# Altium schematic sheet Page06 CPU IO.SchDoc
size 513 x 386 mm
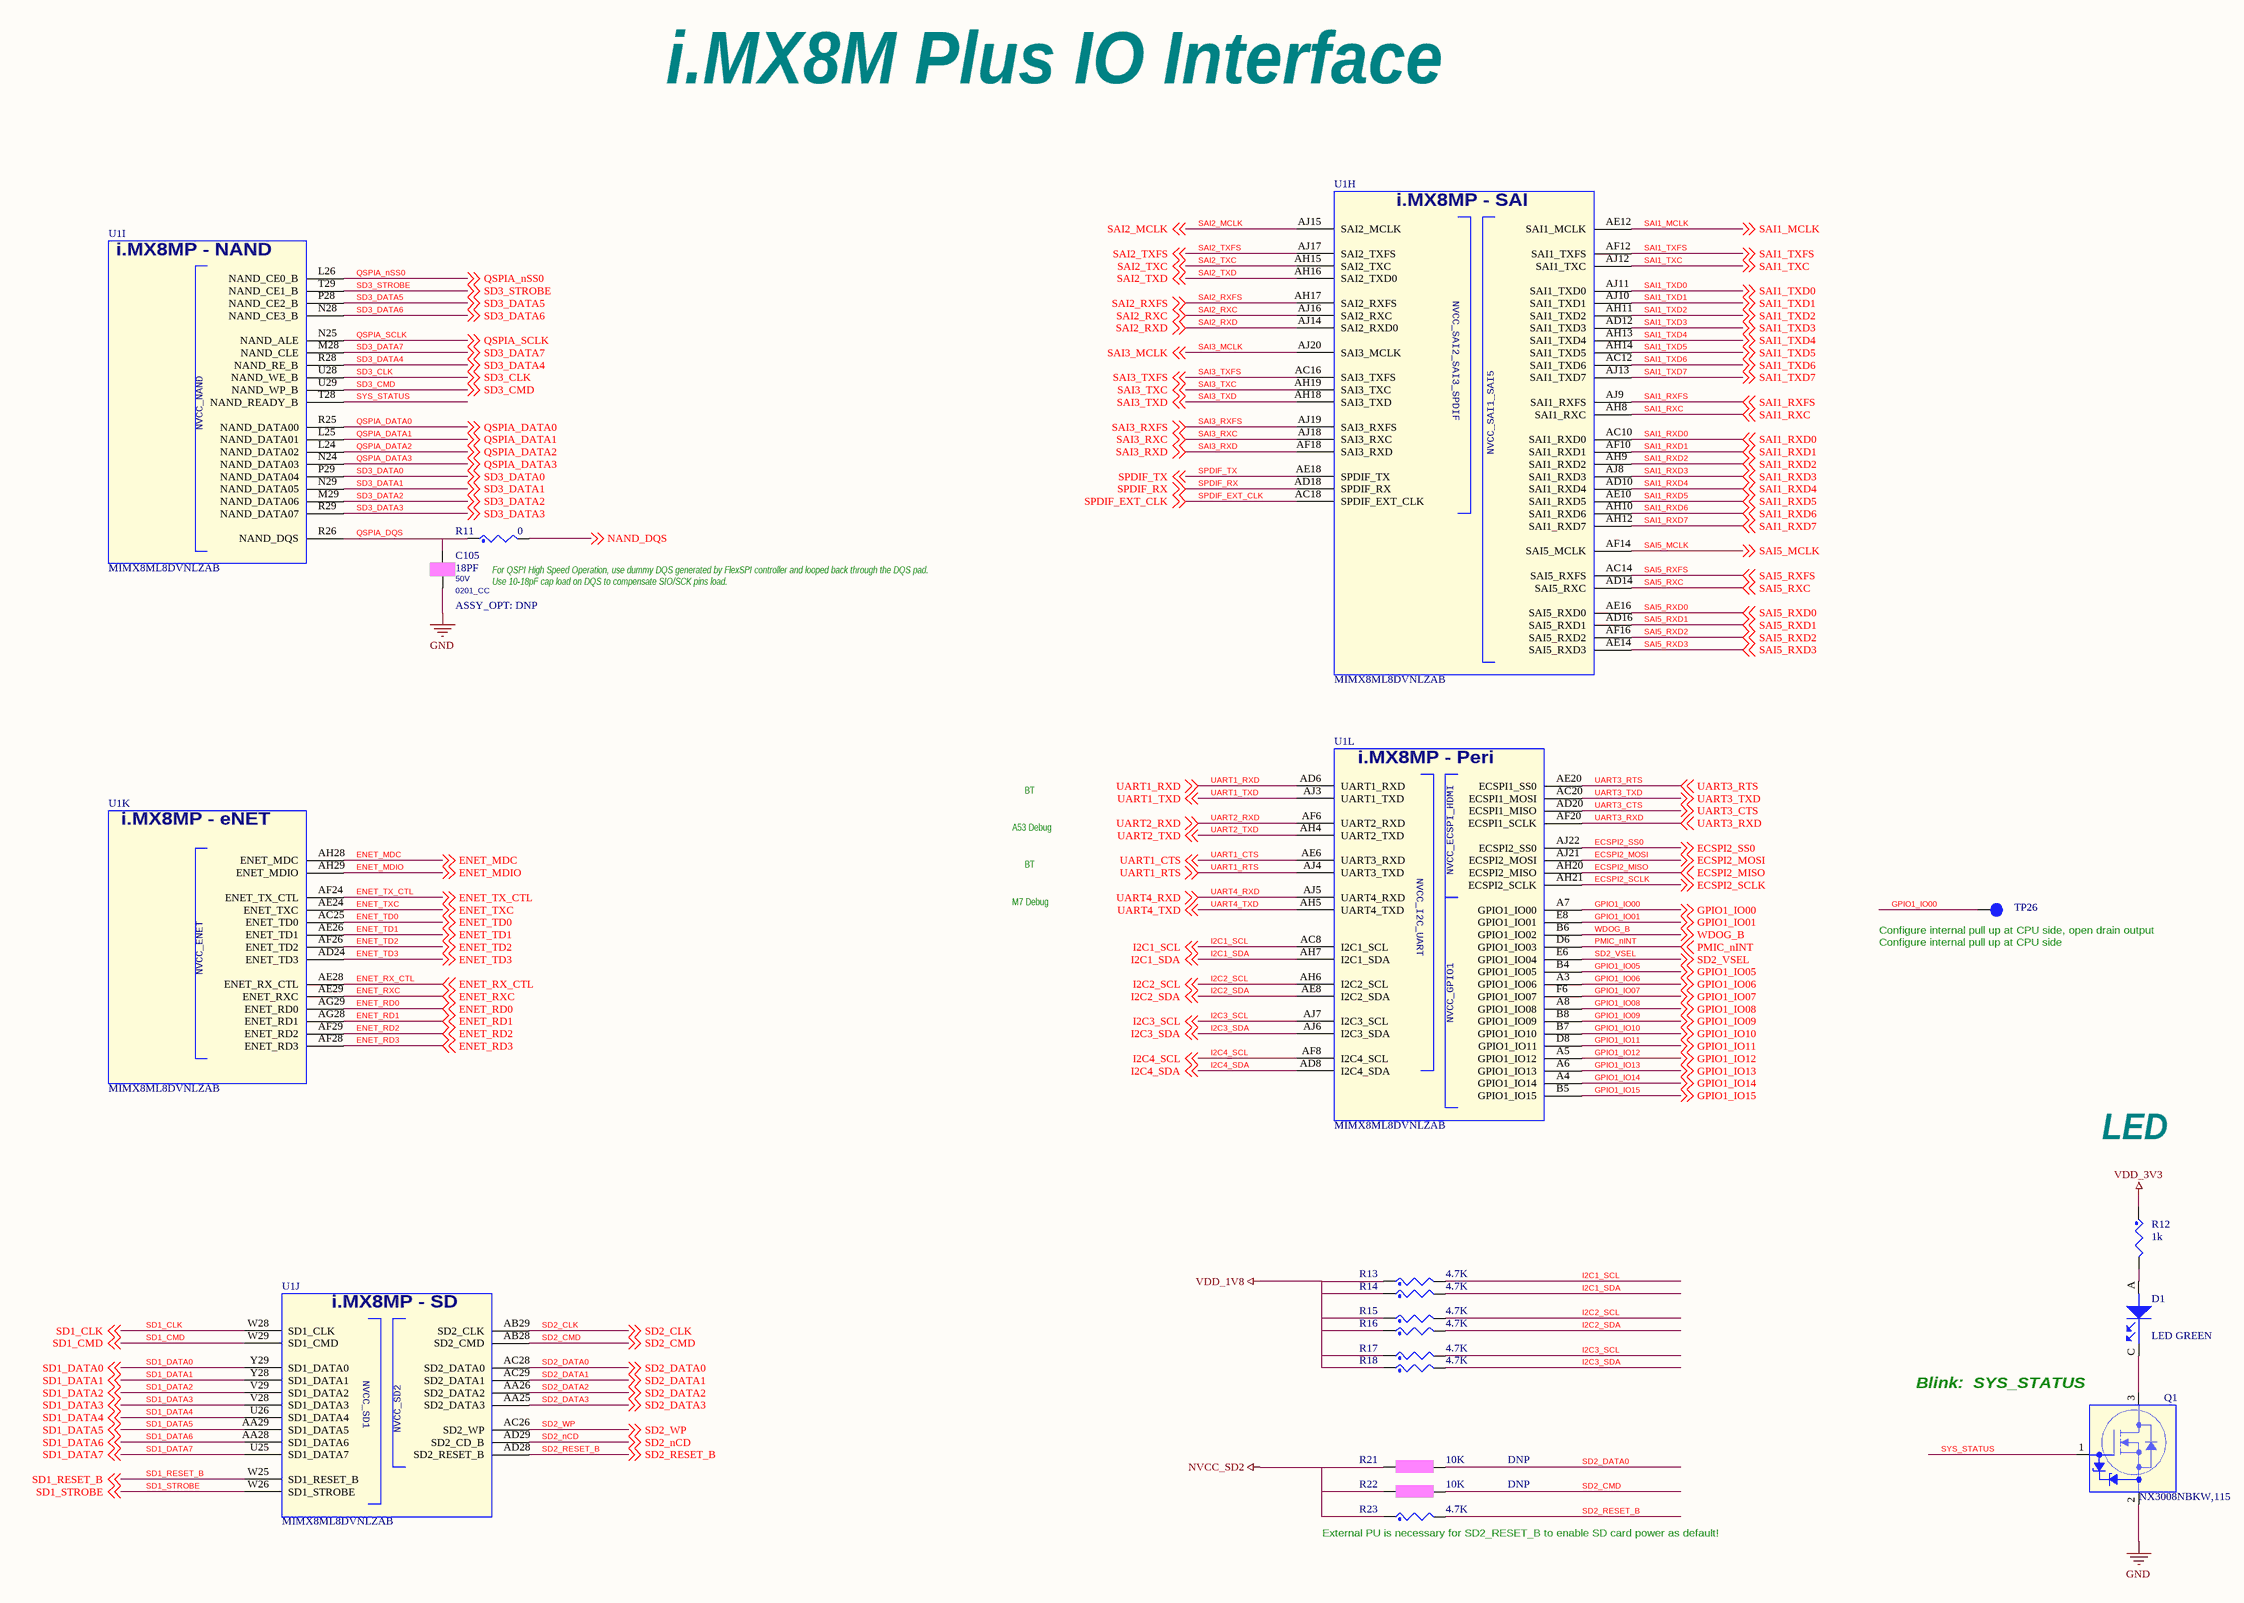
[diagram p0: Page06 CPU IO.SchDoc]

## Parts
C105  18PF  ASSY_OPT: DNP  VOLTAGE: 50V  [0201_CC]
D1  LED GREEN  [LED_0603]
Q1  NX3008NBKW,115  [sc70_3]
R11  0  [RC0402_25]
R12  1k  [0402_CC]
R13  4.7K  [0201_CC]
R14  4.7K  [0201_CC]
R15  4.7K  [0201_CC]
R16  4.7K  [0201_CC]
R17  4.7K  [0201_CC]
R18  4.7K  [0201_CC]
R21  10K  ASSY_OPT: DNP  [0201_CC]
R22  10K  ASSY_OPT: DNP  [0201_CC]
R23  4.7K  [0201_CC]
TP26  tpad_020  [tpad_020]  (value not drawn)
U1  MIMX8ML8DVNLZAB  [BGA_M865S_0P5_15X15-BMS]  (parts H,I,J,K,L of 15)

## Nets
GND: C105.2 Q1.2(SOURCE)
NVCC_SD2: R21.1 R22.1 R23.1
VDD_1V8: R13.1 R14.1 R15.1 R16.1 R17.1 R18.1
VDD_3V3: R12.1
ECSPI2_MISO: U1.AH20(ECSPI2_MISO) ; off-sheet ECSPI2_MISO
ECSPI2_MOSI: U1.AJ21(ECSPI2_MOSI) ; off-sheet ECSPI2_MOSI
ECSPI2_SCLK: U1.AH21(ECSPI2_SCLK) ; off-sheet ECSPI2_SCLK
ECSPI2_SS0: U1.AJ22(ECSPI2_SS0) ; off-sheet ECSPI2_SS0
ENET_MDC: U1.AH28(ENET_MDC) ; off-sheet ENET_MDC
ENET_MDIO: U1.AH29(ENET_MDIO) ; off-sheet ENET_MDIO
ENET_RD0: U1.AG29(ENET_RD0) ; off-sheet ENET_RD0
ENET_RD1: U1.AG28(ENET_RD1) ; off-sheet ENET_RD1
ENET_RD2: U1.AF29(ENET_RD2) ; off-sheet ENET_RD2
ENET_RD3: U1.AF28(ENET_RD3) ; off-sheet ENET_RD3
ENET_RX_CTL: U1.AE28(ENET_RX_CTL) ; off-sheet ENET_RX_CTL
ENET_RXC: U1.AE29(ENET_RXC) ; off-sheet ENET_RXC
ENET_TD0: U1.AC25(ENET_TD0) ; off-sheet ENET_TD0
ENET_TD1: U1.AE26(ENET_TD1) ; off-sheet ENET_TD1
ENET_TD2: U1.AF26(ENET_TD2) ; off-sheet ENET_TD2
ENET_TD3: U1.AD24(ENET_TD3) ; off-sheet ENET_TD3
ENET_TX_CTL: U1.AF24(ENET_TX_CTL) ; off-sheet ENET_TX_CTL
ENET_TXC: U1.AE24(ENET_TXC) ; off-sheet ENET_TXC
GPIO1_IO00: TP26.1(Pin1) U1.A7(GPIO1_IO00) ; off-sheet GPIO1_IO00
GPIO1_IO01: U1.E8(GPIO1_IO01) ; off-sheet GPIO1_IO01
GPIO1_IO05: U1.B4(GPIO1_IO05) ; off-sheet GPIO1_IO05
GPIO1_IO06: U1.A3(GPIO1_IO06) ; off-sheet GPIO1_IO06
GPIO1_IO07: U1.F6(GPIO1_IO07) ; off-sheet GPIO1_IO07
GPIO1_IO08: U1.A8(GPIO1_IO08) ; off-sheet GPIO1_IO08
GPIO1_IO09: U1.B8(GPIO1_IO09) ; off-sheet GPIO1_IO09
GPIO1_IO10: U1.B7(GPIO1_IO10) ; off-sheet GPIO1_IO10
GPIO1_IO11: U1.D8(GPIO1_IO11) ; off-sheet GPIO1_IO11
GPIO1_IO12: U1.A5(GPIO1_IO12) ; off-sheet GPIO1_IO12
GPIO1_IO13: U1.A6(GPIO1_IO13) ; off-sheet GPIO1_IO13
GPIO1_IO14: U1.A4(GPIO1_IO14) ; off-sheet GPIO1_IO14
GPIO1_IO15: U1.B5(GPIO1_IO15) ; off-sheet GPIO1_IO15
I2C1_SCL: R13.2 U1.AC8(I2C1_SCL) ; off-sheet I2C1_SCL
I2C1_SDA: R14.2 U1.AH7(I2C1_SDA) ; off-sheet I2C1_SDA
I2C2_SCL: R15.2 U1.AH6(I2C2_SCL) ; off-sheet I2C2_SCL
I2C2_SDA: R16.2 U1.AE8(I2C2_SDA) ; off-sheet I2C2_SDA
I2C3_SCL: R17.2 U1.AJ7(I2C3_SCL) ; off-sheet I2C3_SCL
I2C3_SDA: R18.2 U1.AJ6(I2C3_SDA) ; off-sheet I2C3_SDA
I2C4_SCL: U1.AF8(I2C4_SCL) ; off-sheet I2C4_SCL
I2C4_SDA: U1.AD8(I2C4_SDA) ; off-sheet I2C4_SDA
NAND_DQS: R11.2 ; off-sheet NAND_DQS
PMIC_nINT: U1.D6(GPIO1_IO03) ; off-sheet PMIC_nINT
QSPIA_DATA0: U1.R25(NAND_DATA00) ; off-sheet QSPIA_DATA0
QSPIA_DATA1: U1.L25(NAND_DATA01) ; off-sheet QSPIA_DATA1
QSPIA_DATA2: U1.L24(NAND_DATA02) ; off-sheet QSPIA_DATA2
QSPIA_DATA3: U1.N24(NAND_DATA03) ; off-sheet QSPIA_DATA3
QSPIA_DQS: C105.1 R11.1 U1.R26(NAND_DQS)
QSPIA_nSS0: U1.L26(NAND_CE0_B) ; off-sheet QSPIA_nSS0
QSPIA_SCLK: U1.N25(NAND_ALE) ; off-sheet QSPIA_SCLK
SAI1_MCLK: U1.AE12(SAI1_MCLK) ; off-sheet SAI1_MCLK
SAI1_RXC: U1.AH8(SAI1_RXC) ; off-sheet SAI1_RXC
SAI1_RXD0: U1.AC10(SAI1_RXD0) ; off-sheet SAI1_RXD0
SAI1_RXD1: U1.AF10(SAI1_RXD1) ; off-sheet SAI1_RXD1
SAI1_RXD2: U1.AH9(SAI1_RXD2) ; off-sheet SAI1_RXD2
SAI1_RXD3: U1.AJ8(SAI1_RXD3) ; off-sheet SAI1_RXD3
SAI1_RXD4: U1.AD10(SAI1_RXD4) ; off-sheet SAI1_RXD4
SAI1_RXD5: U1.AE10(SAI1_RXD5) ; off-sheet SAI1_RXD5
SAI1_RXD6: U1.AH10(SAI1_RXD6) ; off-sheet SAI1_RXD6
SAI1_RXD7: U1.AH12(SAI1_RXD7) ; off-sheet SAI1_RXD7
SAI1_RXFS: U1.AJ9(SAI1_RXFS) ; off-sheet SAI1_RXFS
SAI1_TXC: U1.AJ12(SAI1_TXC) ; off-sheet SAI1_TXC
SAI1_TXD0: U1.AJ11(SAI1_TXD0) ; off-sheet SAI1_TXD0
SAI1_TXD1: U1.AJ10(SAI1_TXD1) ; off-sheet SAI1_TXD1
SAI1_TXD2: U1.AH11(SAI1_TXD2) ; off-sheet SAI1_TXD2
SAI1_TXD3: U1.AD12(SAI1_TXD3) ; off-sheet SAI1_TXD3
SAI1_TXD4: U1.AH13(SAI1_TXD4) ; off-sheet SAI1_TXD4
SAI1_TXD5: U1.AH14(SAI1_TXD5) ; off-sheet SAI1_TXD5
SAI1_TXD6: U1.AC12(SAI1_TXD6) ; off-sheet SAI1_TXD6
SAI1_TXD7: U1.AJ13(SAI1_TXD7) ; off-sheet SAI1_TXD7
SAI1_TXFS: U1.AF12(SAI1_TXFS) ; off-sheet SAI1_TXFS
SAI2_MCLK: U1.AJ15(SAI2_MCLK) ; off-sheet SAI2_MCLK
SAI2_RXC: U1.AJ16(SAI2_RXC) ; off-sheet SAI2_RXC
SAI2_RXD: U1.AJ14(SAI2_RXD0) ; off-sheet SAI2_RXD
SAI2_RXFS: U1.AH17(SAI2_RXFS) ; off-sheet SAI2_RXFS
SAI2_TXC: U1.AH15(SAI2_TXC) ; off-sheet SAI2_TXC
SAI2_TXD: U1.AH16(SAI2_TXD0) ; off-sheet SAI2_TXD
SAI2_TXFS: U1.AJ17(SAI2_TXFS) ; off-sheet SAI2_TXFS
SAI3_MCLK: U1.AJ20(SAI3_MCLK) ; off-sheet SAI3_MCLK
SAI3_RXC: U1.AJ18(SAI3_RXC) ; off-sheet SAI3_RXC
SAI3_RXD: U1.AF18(SAI3_RXD) ; off-sheet SAI3_RXD
SAI3_RXFS: U1.AJ19(SAI3_RXFS) ; off-sheet SAI3_RXFS
SAI3_TXC: U1.AH19(SAI3_TXC) ; off-sheet SAI3_TXC
SAI3_TXD: U1.AH18(SAI3_TXD) ; off-sheet SAI3_TXD
SAI3_TXFS: U1.AC16(SAI3_TXFS) ; off-sheet SAI3_TXFS
SAI5_MCLK: U1.AF14(SAI5_MCLK) ; off-sheet SAI5_MCLK
SAI5_RXC: U1.AD14(SAI5_RXC) ; off-sheet SAI5_RXC
SAI5_RXD0: U1.AE16(SAI5_RXD0) ; off-sheet SAI5_RXD0
SAI5_RXD1: U1.AD16(SAI5_RXD1) ; off-sheet SAI5_RXD1
SAI5_RXD2: U1.AF16(SAI5_RXD2) ; off-sheet SAI5_RXD2
SAI5_RXD3: U1.AE14(SAI5_RXD3) ; off-sheet SAI5_RXD3
SAI5_RXFS: U1.AC14(SAI5_RXFS) ; off-sheet SAI5_RXFS
SD1_CLK: U1.W28(SD1_CLK) ; off-sheet SD1_CLK
SD1_CMD: U1.W29(SD1_CMD) ; off-sheet SD1_CMD
SD1_DATA0: U1.Y29(SD1_DATA0) ; off-sheet SD1_DATA0
SD1_DATA1: U1.Y28(SD1_DATA1) ; off-sheet SD1_DATA1
SD1_DATA2: U1.V29(SD1_DATA2) ; off-sheet SD1_DATA2
SD1_DATA3: U1.V28(SD1_DATA3) ; off-sheet SD1_DATA3
SD1_DATA4: U1.U26(SD1_DATA4) ; off-sheet SD1_DATA4
SD1_DATA5: U1.AA29(SD1_DATA5) ; off-sheet SD1_DATA5
SD1_DATA6: U1.AA28(SD1_DATA6) ; off-sheet SD1_DATA6
SD1_DATA7: U1.U25(SD1_DATA7) ; off-sheet SD1_DATA7
SD1_RESET_B: U1.W25(SD1_RESET_B) ; off-sheet SD1_RESET_B
SD1_STROBE: U1.W26(SD1_STROBE) ; off-sheet SD1_STROBE
SD2_CLK: U1.AB29(SD2_CLK) ; off-sheet SD2_CLK
SD2_CMD: R22.2 U1.AB28(SD2_CMD) ; off-sheet SD2_CMD
SD2_DATA0: R21.2 U1.AC28(SD2_DATA0) ; off-sheet SD2_DATA0
SD2_DATA1: U1.AC29(SD2_DATA1) ; off-sheet SD2_DATA1
SD2_DATA2: U1.AA26(SD2_DATA2) ; off-sheet SD2_DATA2
SD2_DATA3: U1.AA25(SD2_DATA3) ; off-sheet SD2_DATA3
SD2_nCD: U1.AD29(SD2_CD_B) ; off-sheet SD2_nCD
SD2_RESET_B: R23.2 U1.AD28(SD2_RESET_B) ; off-sheet SD2_RESET_B
SD2_VSEL: U1.E6(GPIO1_IO04) ; off-sheet SD2_VSEL
SD2_WP: U1.AC26(SD2_WP) ; off-sheet SD2_WP
SD3_CLK: U1.U28(NAND_WE_B) ; off-sheet SD3_CLK
SD3_CMD: U1.U29(NAND_WP_B) ; off-sheet SD3_CMD
SD3_DATA0: U1.P29(NAND_DATA04) ; off-sheet SD3_DATA0
SD3_DATA1: U1.N29(NAND_DATA05) ; off-sheet SD3_DATA1
SD3_DATA2: U1.M29(NAND_DATA06) ; off-sheet SD3_DATA2
SD3_DATA3: U1.R29(NAND_DATA07) ; off-sheet SD3_DATA3
SD3_DATA4: U1.R28(NAND_RE_B) ; off-sheet SD3_DATA4
SD3_DATA5: U1.P28(NAND_CE2_B) ; off-sheet SD3_DATA5
SD3_DATA6: U1.N28(NAND_CE3_B) ; off-sheet SD3_DATA6
SD3_DATA7: U1.M28(NAND_CLE) ; off-sheet SD3_DATA7
SD3_STROBE: U1.T29(NAND_CE1_B) ; off-sheet SD3_STROBE
SPDIF_EXT_CLK: U1.AC18(SPDIF_EXT_CLK) ; off-sheet SPDIF_EXT_CLK
SPDIF_RX: U1.AD18(SPDIF_RX) ; off-sheet SPDIF_RX
SPDIF_TX: U1.AE18(SPDIF_TX) ; off-sheet SPDIF_TX
SYS_STATUS: Q1.1(GATE) U1.T28(NAND_READY_B)
UART1_CTS: U1.AE6(UART3_RXD) ; off-sheet UART1_CTS
UART1_RTS: U1.AJ4(UART3_TXD) ; off-sheet UART1_RTS
UART1_RXD: U1.AD6(UART1_RXD) ; off-sheet UART1_RXD
UART1_TXD: U1.AJ3(UART1_TXD) ; off-sheet UART1_TXD
UART2_RXD: U1.AF6(UART2_RXD) ; off-sheet UART2_RXD
UART2_TXD: U1.AH4(UART2_TXD) ; off-sheet UART2_TXD
UART3_CTS: U1.AD20(ECSPI1_MISO) ; off-sheet UART3_CTS
UART3_RTS: U1.AE20(ECSPI1_SS0) ; off-sheet UART3_RTS
UART3_RXD: U1.AF20(ECSPI1_SCLK) ; off-sheet UART3_RXD
UART3_TXD: U1.AC20(ECSPI1_MOSI) ; off-sheet UART3_TXD
UART4_RXD: U1.AJ5(UART4_RXD) ; off-sheet UART4_RXD
UART4_TXD: U1.AH5(UART4_TXD) ; off-sheet UART4_TXD
WDOG_B: U1.B6(GPIO1_IO02) ; off-sheet WDOG_B
NetD1_A: D1.A(ANODE) R12.2
NetD1_C: D1.C(CATHODE) Q1.3(DRAIN)

## Notes on the sheet
- i.MX8M Plus IO Interface
- (near R11) For QSPI High Speed Operation, use dummy DQS generated by FlexSPI controller and looped back through the DQS pad.
  Use 10-18pF cap load on DQS to compensate SIO/SCK pins load.
- A53 Debug
- BT
- M7 Debug
- (near TP26) Configure internal pull up at CPU side
- (near TP26) Configure internal pull up at CPU side, open drain output
- LED
- (near Q1) Blink:  SYS_STATUS
- (near R23) External PU is necessary for SD2_RESET_B to enable SD card power as default!
- (in symbol MIMX8MP_BGA548, part H) i.MX8MP - SAI
- (in symbol MIMX8MP_BGA548, part I) i.MX8MP - NAND
- (in symbol MIMX8MP_BGA548, part J) i.MX8MP - SD
- (in symbol MIMX8MP_BGA548, part K) i.MX8MP - eNET
- (in symbol MIMX8MP_BGA548, part L) i.MX8MP - Peri; NVCC_GPIO1

## Library data of the parts
C105 = CAP_NP: CAP CER 18pF 50V 5% C0G 0201; CLASS: DISCRETE; FPLIST: CC0201,CC0201_HD,0201_CC; CAD_APPROVED: Yes; MFG_PN01: GRM0335C1H180JA01D; MFG_NAME01: MURATA; AGILE_PN: 150-79476; Package Type: &#966;180mm Paper taping; Package Size: 0201; HEIGHT: 0.33MM; ROHS: Yes; Tolerance: 5%; PCB Footprint: 0201_CC
D1 = LED: LED GRN SGL 25MA SMT 0603; CLASS: IC; CAD_APPROVED: Yes; MFG_PN01: 598-8070-107F; MFG_NAME01: DIALIGHT; AGILE_PN: 370-76672; VOLTAGE: 2V; HEIGHT: 0.8 MM; ROHS: Yes; PCB Footprint: LED_0603
Q1 = NMOS_NX3008NBK: TRAN NMOS SW 30V 350mA AEC-Q101 SC-70; CLASS: IC; AGILE_PN: 480-79736; MFG_NAME01: NEXPERIA; CAD_APPROVED: Yes; PCB Footprint: sc70_3; MFG_PN01: NX3008NBKW,115; ROHS: Yes; HEIGHT: 1.1MM
R11 = RES: RES MF ZERO OHM 1/16W 5% 0402; CLASS: DISCRETE; SIGNAL_MODEL: DEFAULT_RESISTOR_10000OHM_2_1; CAD_APPROVED: Yes; MFG_PN01: MCR01MZPJ000; MFG_NAME01: ROHM; AGILE_PN: 470-75394; VOLTAGE: 1/16W; HEIGHT: 0.45 MM; ROHS: Yes; Tolerance: 5%; PCB Footprint: RC0402_25
R12 = RES: RES MF 1.0K 1/16W 5% 0402; CLASS: DISCRETE; AGILE_PN: 470-75555; MFG_NAME01: VISHAY INTERTECHNOLOGY; MFG_PN01: CRCW04021K00JNED; CAD_APPROVED: Yes; FPLIST: RC0402_25,RC0402_HD,RC0402_X2,0402_CC; HEIGHT: 0.41mm; TOL: 5%; Tolerance: 5%; ROHS: Yes; PCB Footprint: 0402_CC
R13 R14 R17 R18 = RES: RES MF 4.7K 1/20W 5% AEC-Q200 0201; CLASS: DISCRETE; AGILE_PN: 470-79700; MFG_NAME01: KOA SPEER; MFG_PN01: RK73B1HTTC472J; Temp_Range: -55C to +155C; CAD_APPROVED: Yes; FPLIST: RC0201,0201_CC; PCB Footprint: 0201_CC; Tolerance: 5%; ROHS: Yes; HEIGHT: 0.25MM; Temp Range: -55C to +155C
R15 R16 R23 = RES: RES MF 4.7K 1/20W 5% AEC-Q200 0201; CLASS: DISCRETE; FPLIST: RC0201,0201_CC; CAD_APPROVED: Yes; Temp_Range: -55C to +155C; MFG_PN01: RK73B1HTTC472J; MFG_NAME01: KOA SPEER; AGILE_PN: 470-79700; PCB Footprint: 0201_CC; HEIGHT: 0.25MM; ROHS: Yes; Tolerance: 5%; Temp Range: -55C to +155C
R21 = RES: RES MF 10K 1/20W 5% 0201; CLASS: DISCRETE; AGILE_PN: 470-79719; MFG_NAME01: RALEC ELECTRONIC CORP; MFG_PN01: RTT01103JTH; CAD_APPROVED: Yes; FPLIST: RC0201,0201_CC; PCB Footprint: 0201_CC; Tolerance: 5%; ROHS: Yes; HEIGHT: 0.26 MM
R22 = RES: RES MF 10K 1/20W 5% 0201; CLASS: DISCRETE; FPLIST: RC0201,0201_CC; CAD_APPROVED: Yes; MFG_PN01: RTT01103JTH; MFG_NAME01: RALEC ELECTRONIC CORP; AGILE_PN: 470-79719; PCB Footprint: 0201_CC; HEIGHT: 0.26 MM; ROHS: Yes; Tolerance: 5%
TP26 = TESTLOOP: TEST POINT PAD 0.5MM DIA SMT, NO PART TO ORDER; ASSY_OPT: DNP; CLASS: IO; AGILE_PN: 211-77484; CAD_APPROVED: Yes; ROHS: Yes; HEIGHT: 0.1MM; PCB Footprint: tpad_020
U1 = MIMX8MP_BGA548: IC CPU QUAD CORTEX A53+M4 1.8GHZ BGA548; SPLIT_INST: TRUE; PCB Footprint: bga548_0p5_15x15mm; CAD_APPROVED: Yes; MFG_NAME01: NXP SEMICONDUCTORS; AGILE_PN: 330-77126; CLASS: IC; HEIGHT: 2.1MM; MFG_PN01: MIMX8ML8DVNLZAB